# EAGLE schematic ESP-DMX (EAGLE 7.7.0)
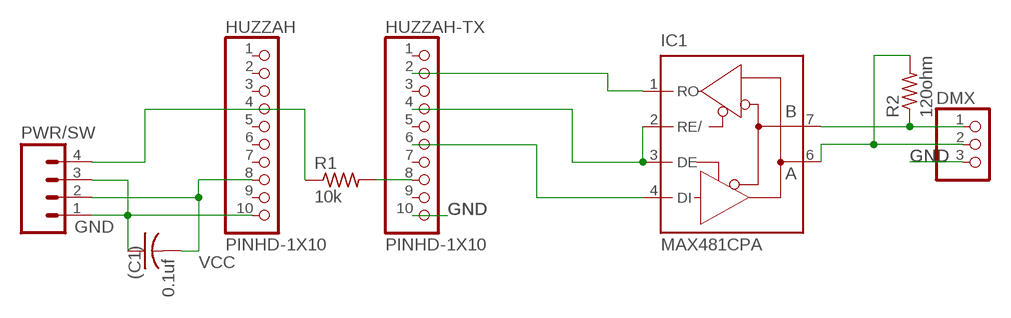
[diagram p0: schematic, sheet 1]

## Parts
(C1)  0.1uf  C-US050-025X075  [C050-025X075]
DMX  PINHD-1X3  [1X03]
HUZZAH  PINHD-1X10  [1X10-BIG]
HUZZAH-TX  PINHD-1X10  [1X10-BIG]
IC1  MAX481CPA  [DIL08]
PWR/SW  1X04_HEADER"  [1X04_HEADER]
R1  10k  RESISTOR1/6WATT  [RESISTOR]
R2  120ohm  RESISTOR1/6WATT  [RESISTOR]

## Nets
GND: (C1).1 DMX.3 HUZZAH-TX.10 HUZZAH.10 PWR/SW.1 PWR/SW.3
N$1: DMX.1 IC1.7(B) R2.1
N$2: DMX.2 IC1.6(A) R2.2
N$3: HUZZAH-TX.6 IC1.4(DI)
N$4: HUZZAH-TX.4 IC1.2(RE/) IC1.3(DE)
N$5: HUZZAH-TX.2 IC1.1(RO)
N$7: HUZZAH-TX.8 R1.2
N$8: HUZZAH.4 PWR/SW.4 R1.1
VCC: (C1).2 HUZZAH.8 PWR/SW.2
Unconnected: HUZZAH-TX.1 HUZZAH-TX.3 HUZZAH-TX.5 HUZZAH-TX.7 HUZZAH-TX.9 HUZZAH.1 HUZZAH.2 HUZZAH.3 HUZZAH.5 HUZZAH.6 HUZZAH.7 HUZZAH.9

## Power pins joined to a net without a drawn wire
GND: IC1.5(GND)
VCC: IC1.8(VCC)

## Library data of the parts
(C1) = resistor:C-US: CAPACITOR, American symbol
DMX = adafruit:PINHD-1X3: PIN HEADER
HUZZAH HUZZAH-TX = adafruit:PINHD-1X10: Pin header 1x10 0.1" spacing With round pins
IC1 = maxim:MAX481CPA: RS485 TRANSEIVER; MPN: MAX481CPA+; OC_FARNELL: unknown; OC_NEWARK: 99K3445
PWR/SW = RBBB:1X04_HEADER: Header 4 Standard 4-pin 0.1" header. Use with straight break away headers (SKU : PRT-00116), right angle break away headers (PRT-00553), swiss pins (PRT-00743), machine pins (PRT-00117), and female headers (PRT-00115). Molex polarized connector foot print use with SKU : PRT-08231 with associated crimp pins and housings.
R1 R2 = RBBB:RESISTOR: RESISTOR, American symbol